# EasyEDA schematic Sheet_1.json
TITLE: Sheet_1; REV: 1.0; Date: 2021-12-08; Sheet: 1/1; Drawn By: kneiheisel; Company: Your Company
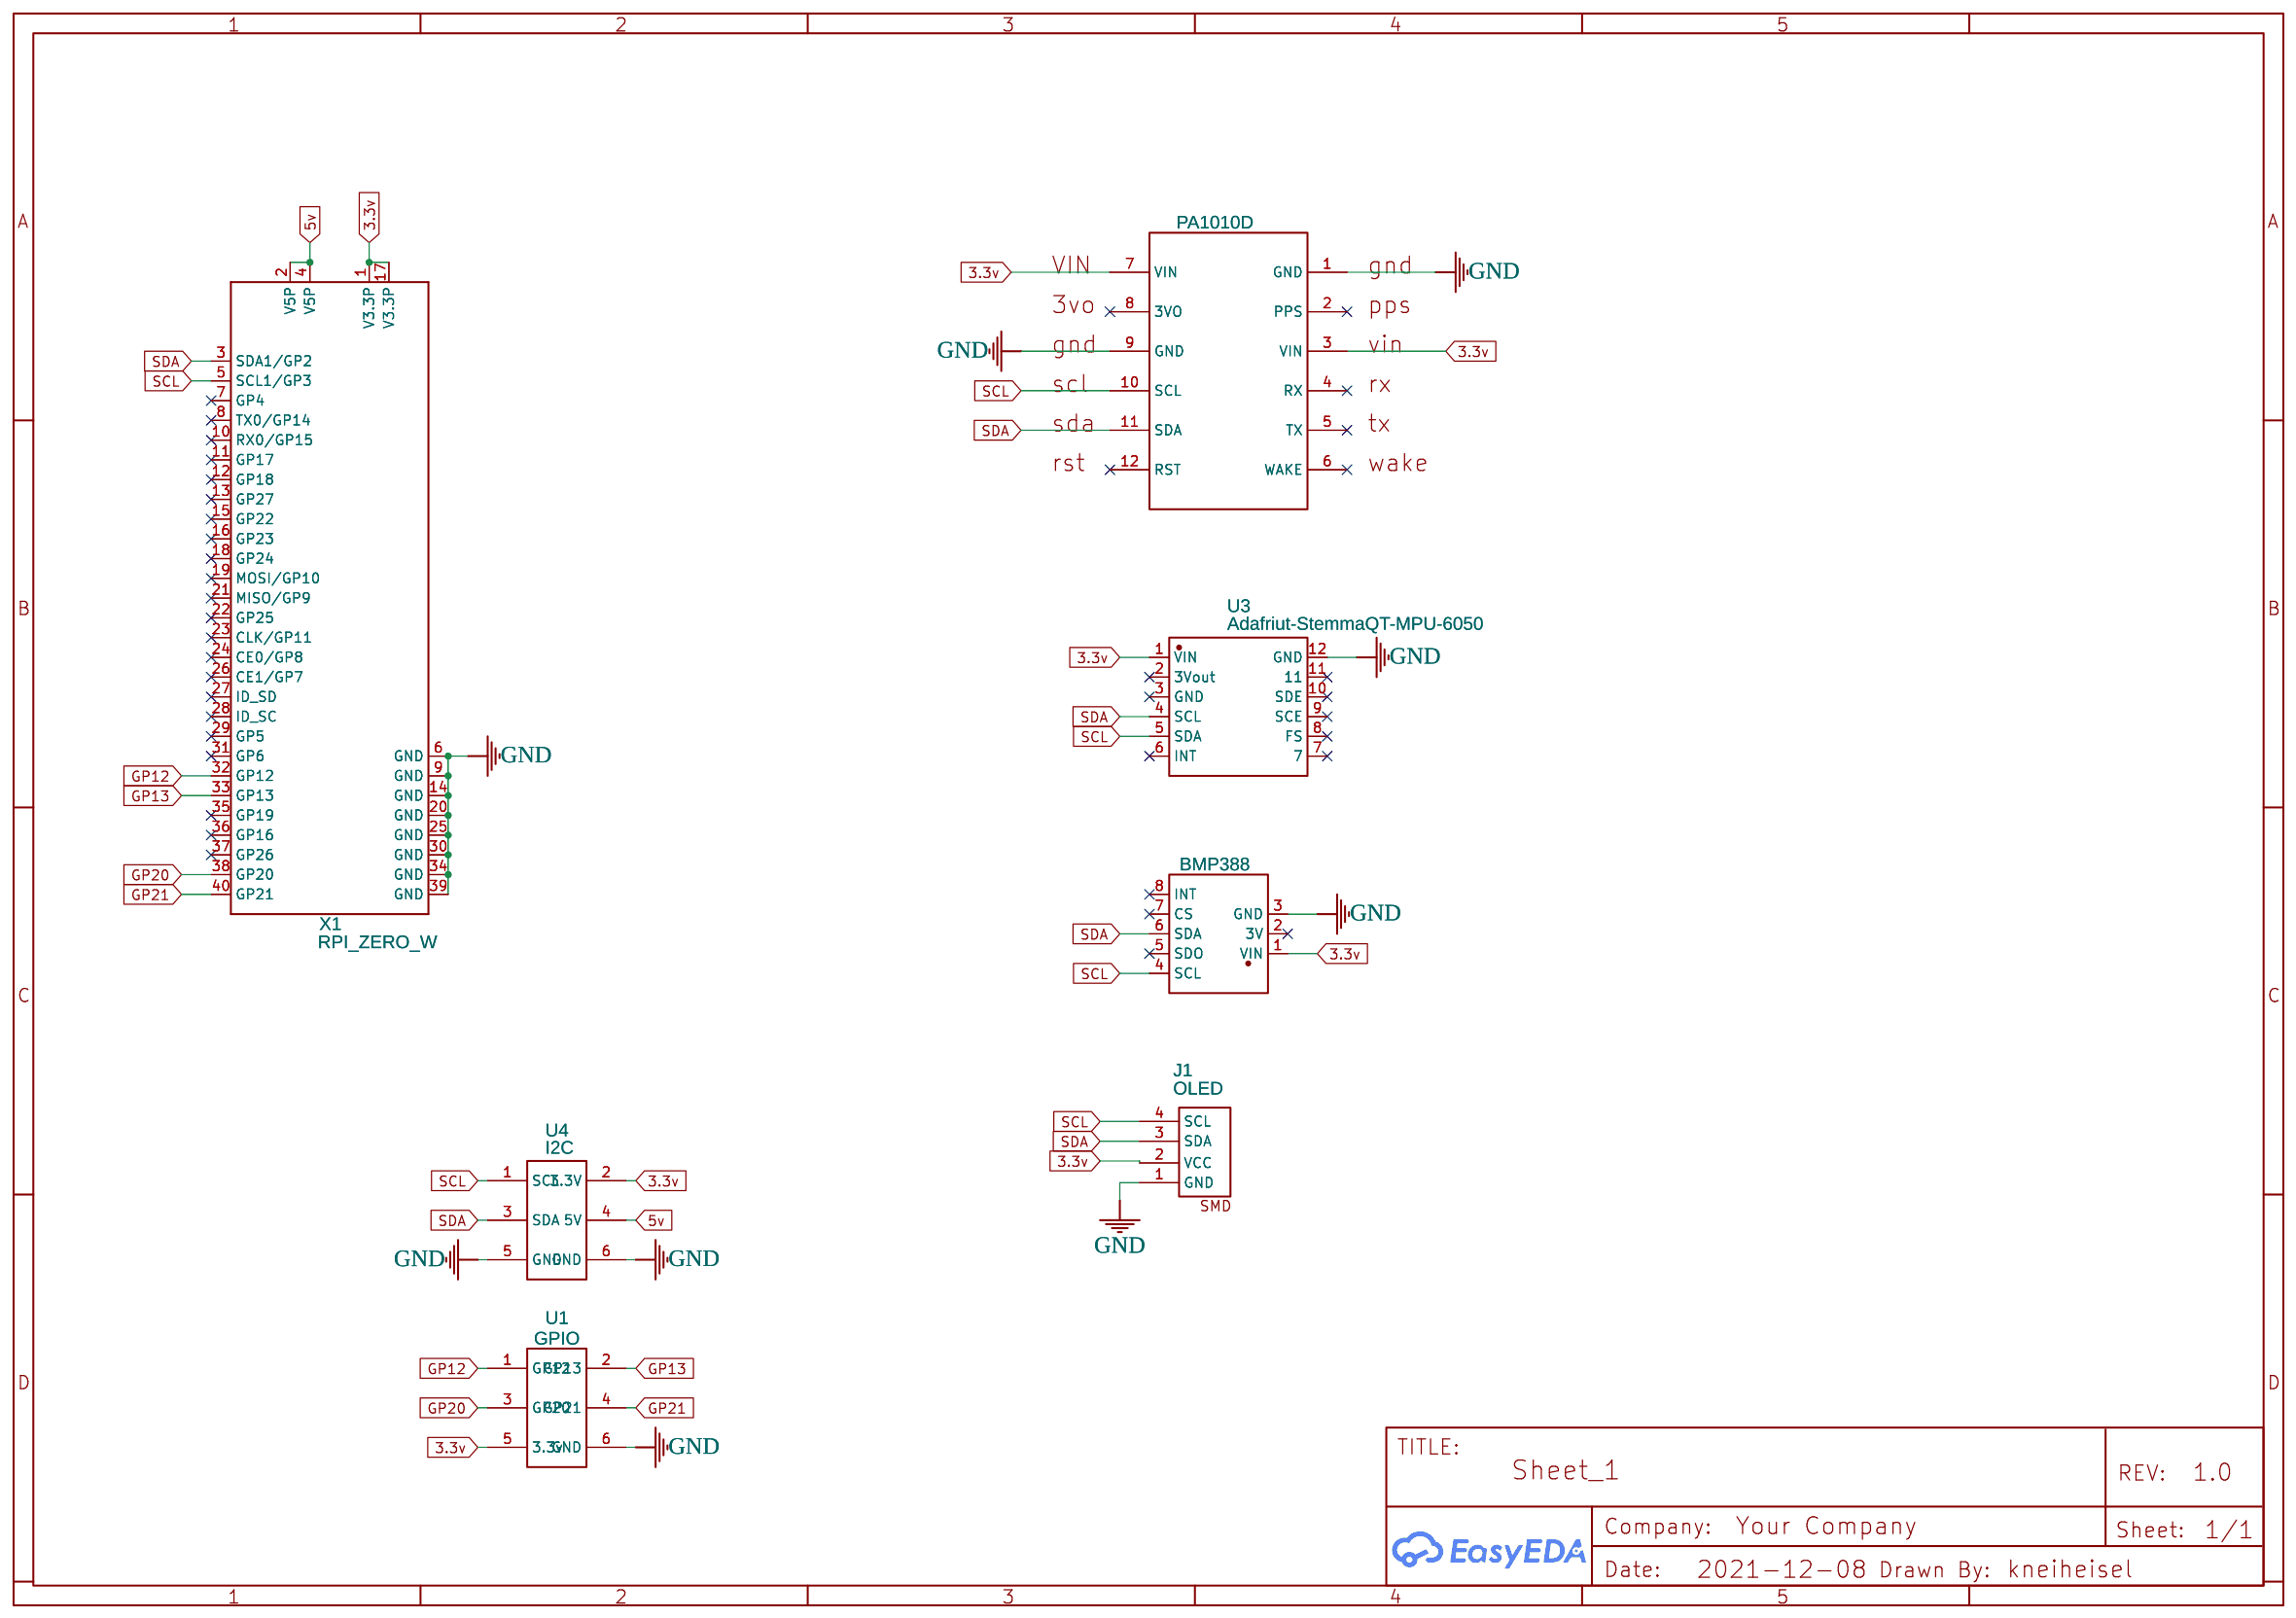
[diagram p0: schematic sheet]

## Parts
J1  OLED  [JST SH 4-PIN I2C-H]
S1  BMP388  [ADAFRUIT BMP388 V2]
U1  GPIO  [2X3 PIN THROUGH HOLE]
U2  PA1010D  [ADAFRUIT PA1010D MINI GPS]
U3  Adafriut-StemmaQT-MPU-6050  [ADAFRUIT-STEMMAQT-MPU6050]
U4  I2C  [2X3 PIN THROUGH HOLE]
X1  RPI_ZERO_W  [RPI_ZERO_W]

## Library data of the parts
J1 = JST SH 4-pin I2C-H: Contributor: laurentsafa
S1 = Adafruit BMP388: Manufacturer: Adafruit; Supplier: Adafruit; link: https://www.adafruit.com/product/3966; Contributor: rorydudley
U1 U4 = 2X3 PINHD: Contributor: Alex1987
U2 = adafruit pa1010d mini gps: Supplier: adafruit; Contributor: Atulya John
U3 = Adafriut-StemmaQT-MPU-6050: Manufacturer: Adafruit; Contributor: nick.antipov
X1 = RPI_ZERO_W

## Nets
3.3v: J1.2(VCC) S1.1(VIN) U1.5(3.3v) U2.3(VIN) U2.7(VIN) U3.1(VIN) U4.2(3.3V) X1.1(V3.3P) X1.17(V3.3P)
5v: U4.4(5V) X1.2(V5P) X1.4(V5P)
GND: J1.1(GND) S1.3(GND) U1.6(GND) U2.1(GND) U2.9(GND) U3.12(GND) U4.5(GND) U4.6(GND) X1.6(GND) X1.9(GND) X1.14(GND) X1.20(GND) X1.25(GND) X1.30(GND) X1.34(GND) X1.39(GND)
GP12: U1.1(GP12) X1.32(GP12)
GP13: U1.2(GP13) X1.33(GP13)
GP20: U1.3(GP20) X1.38(GP20)
GP21: U1.4(GP21) X1.40(GP21)
SCL: J1.4(SCL) S1.4(SCL) U2.10(SCL) U3.5(SDA) U4.1(SCL) X1.5(SCL1/GP3)
SDA: J1.3(SDA) S1.6(SDA) U2.11(SDA) U3.4(SCL) U4.3(SDA) X1.3(SDA1/GP2)

Not connected (* = marked no-connect by the designer): S1 2(3V)* 5(SDO)* 7(CS)* 8(INT)*; U2 2(PPS)* 4(RX)* 5(TX)* 6(WAKE)* 8(3VO)* 12(RST)*; U3 2(3Vout)* 3(GND)* 6(INT)* 7* 8(FS)* 9(SCE)* 10(SDE)* 11*; X1 7(GP4)* 8(TX0/GP14)* 10(RX0/GP15)* 11(GP17)* 12(GP18)* 13(GP27)* 15(GP22)* 16(GP23)* 18(GP24)* 19(MOSI/GP10)* 21(MISO/GP9)* 22(GP25)* 23(CLK/GP11)* 24(CE0/GP8)* 26(CE1/GP7)* 27(ID_SD)* 28(ID_SC)* 29(GP5)* 31(GP6)* 35(GP19)* 36(GP16)* 37(GP26)*
